# EAGLE design brick_i2c_3axis_adxl345 (EAGLE 7.4.0)
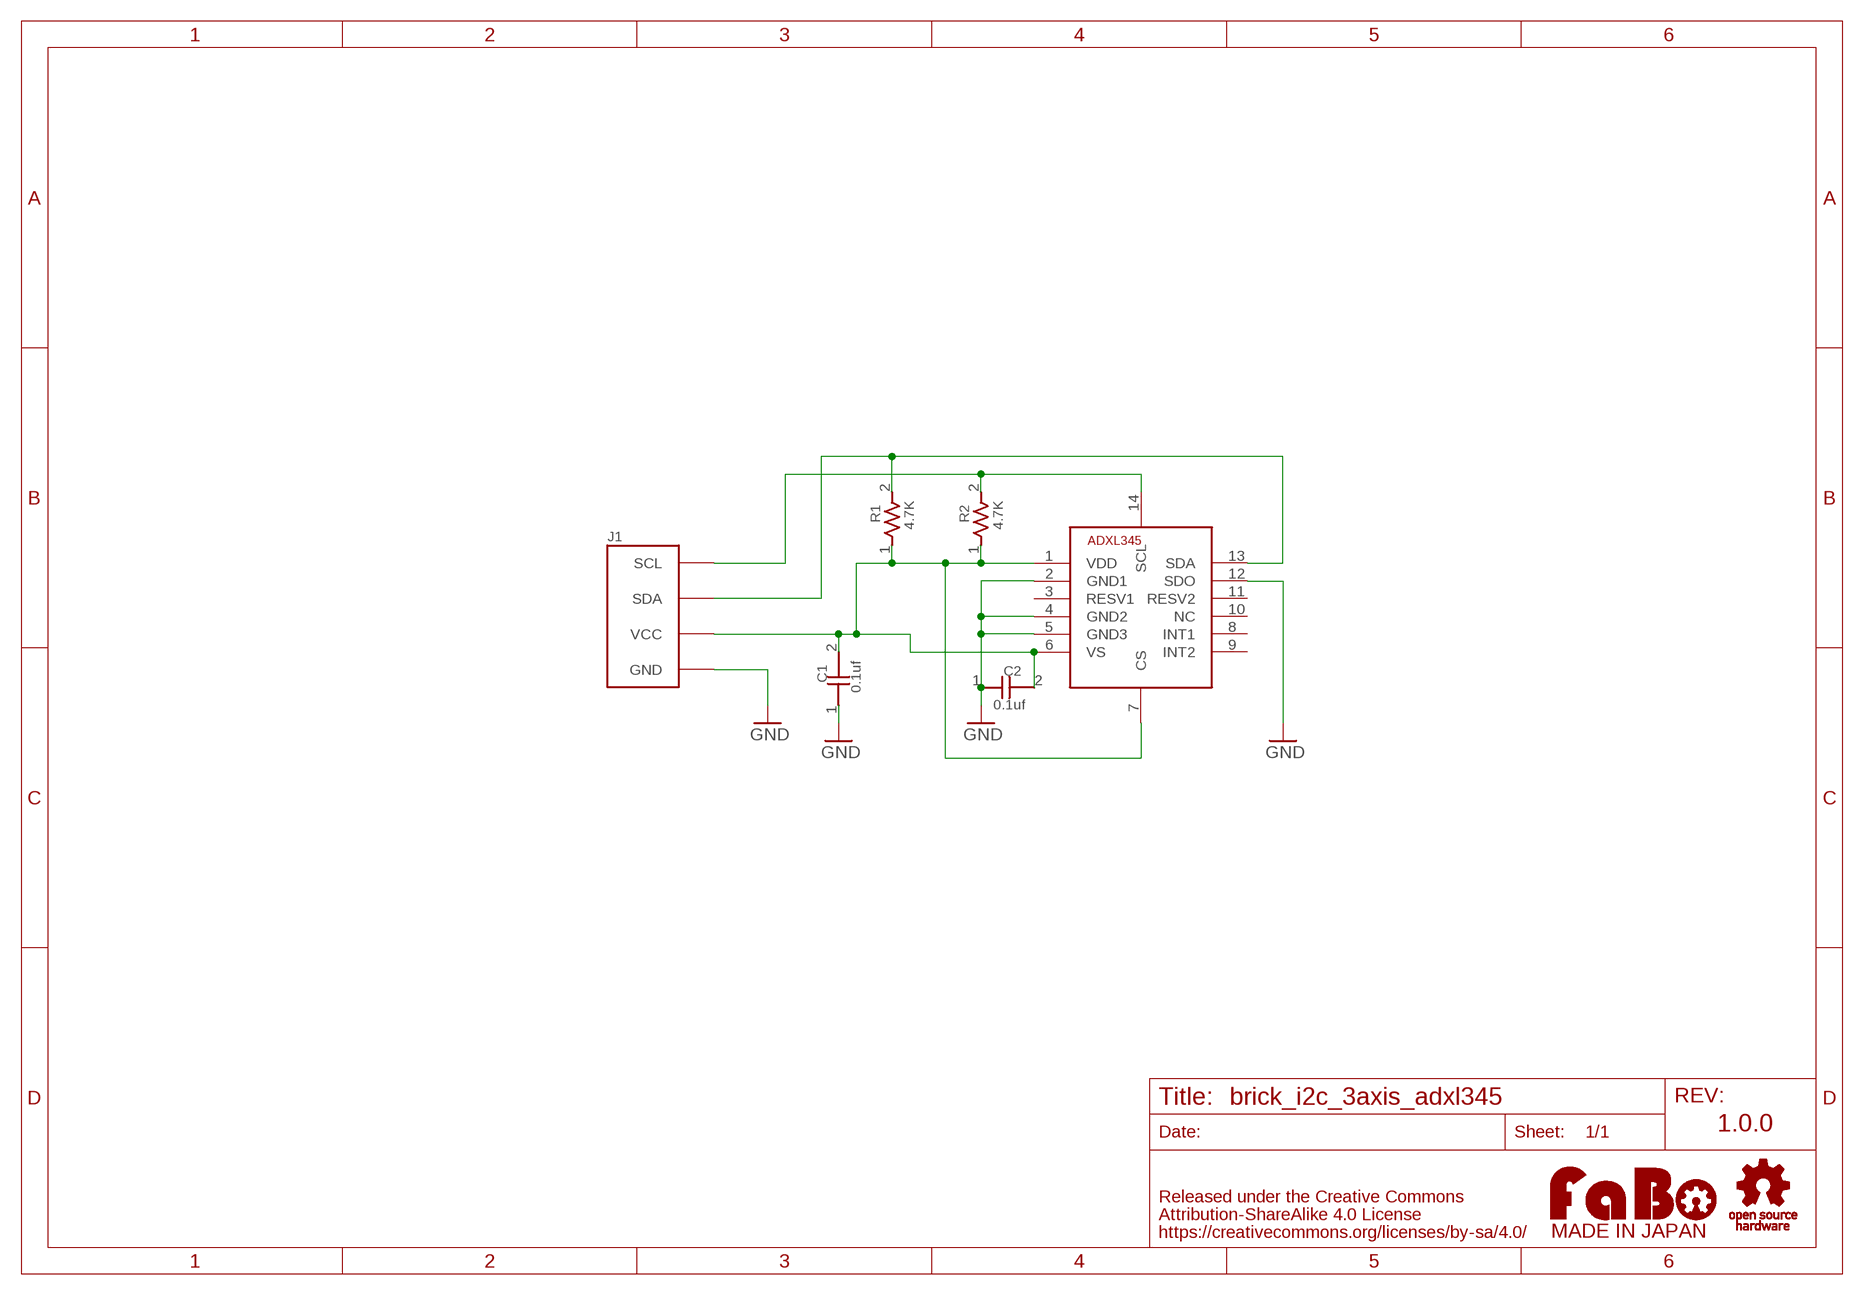
[diagram p0: schematic, sheet 1]

## Parts
C1  0.1uf  CAPACITOR0603  [0603]
C2  0.1uf  CAPACITOR0603  [0603]
J1  BRICK_I2C  [BRICK_I2C]
R1  4.7K  RESISTOR0603  [0603]
R2  4.7K  RESISTOR0603  [0603]
U$2  ANALOGDEVICES-ADXL345  [ANALOGDEVICES-ADXL345]
U$3  LOGO_OSHW_T-M  [LOGO_OSHW_T_M]
U$4  LOGO_FABO-M  [LOGO_FABO_M]

## Nets
GND: C1.1 C2.1 J1.GND U$2.2(GND1) U$2.4(GND2) U$2.5(GND3) U$2.12(SDO)
N$1: C1.2 C2.2 J1.VCC R1.1 R2.1 U$2.1(VDD) U$2.6(VS) U$2.7(CS)
N$3: J1.SDA R1.2 U$2.13(SDA)
N$4: J1.SCL R2.2 U$2.14(SCL)
Unconnected: U$2.3(RESV1) U$2.8(INT1) U$2.9(INT2) U$2.10(NC) U$2.11(RESV2)

## Notes on the sheet
- 1.0.0

## Library data of the parts
C1 C2 = GClue-Capacitor:CAPACITOR
J1 = gclue:BRICK_I2C: FaBo Brick 4pin(I2C)
R1 R2 = GClue-Resistors:RESISTOR
U$2 = GClue-Mems:ANALOGDEVICES-ADXL345
U$3 = gclue:LOGO_OSHW_T
U$4 = FaBo-etc:LOGO_FABO

## Net classes
0 default: width 0.254 mm

## Board
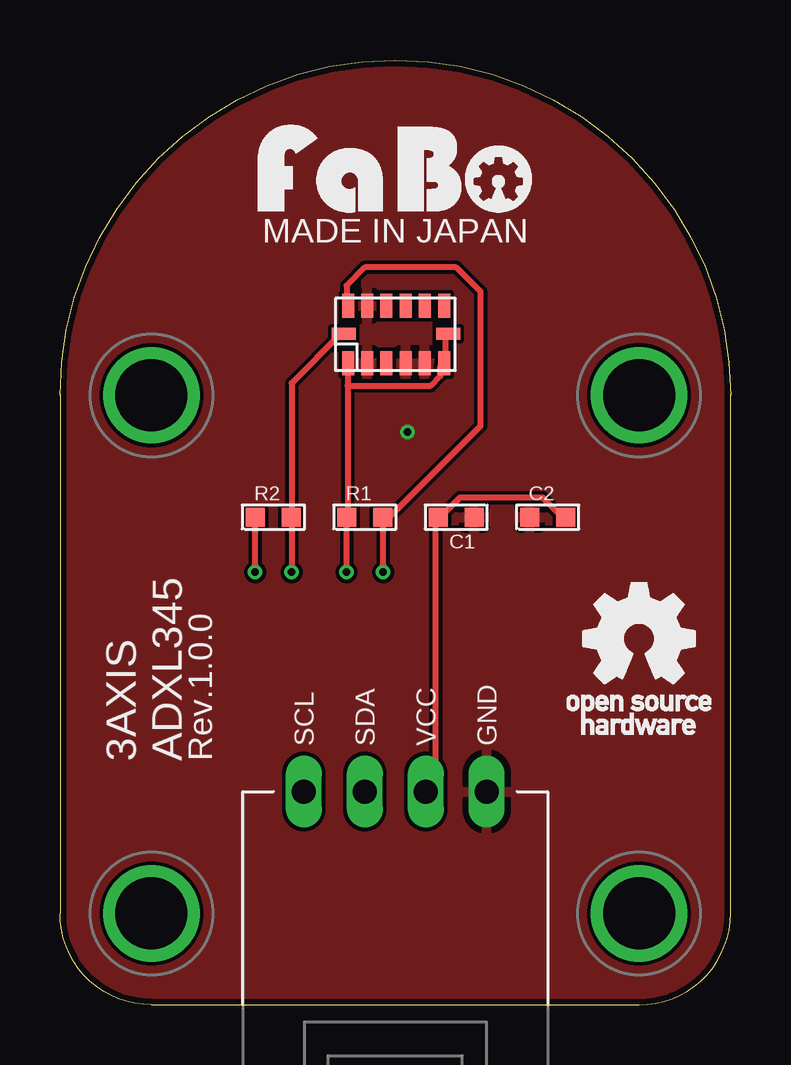
[diagram p1: board, top side]
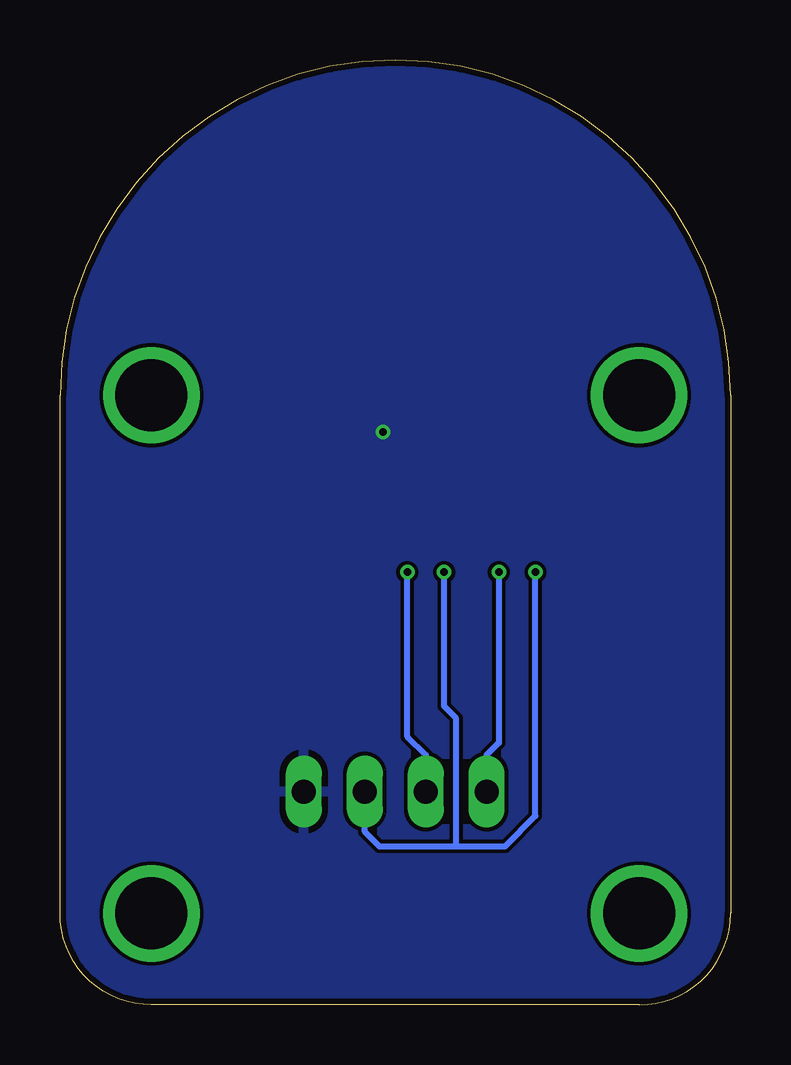
[diagram p2: board, bottom side, seen from below]

Size 27.94 x 39.37 mm. Coordinates in mm from the lower left corner, seen from the top.
Copper layers (1*16): Top 0.035mm / dielectric 1.5mm / Bottom 0.035mm
Design rules "Elecrow_2-layer_eagle_rule": minimum track width 6mil, minimum drill 12mil, track to track 6mil, track to pad 6mil, pad to pad 6mil, via to via 6mil, smd to smd 0mil, copper to edge 10mil, drill to drill 10mil, minimum pad ring 10mil, minimum via ring 6mil, stop-mask expansion 2mil, vias tented up to drill 100mil, thermal gap 10mil

### Footprints (pad centres in the part's own frame; a part is rotated, then mirrored left to right if it is on the bottom)
0603 = smd 0.8 x 0.8: 1 -0.75,0; 2 0.75,0
BRICK_I2C = drill 1 long: GND 3.81,-10.16; SCL -3.81,-10.16; SDA -1.27,-10.16; VCC 1.27,-10.16 | drill 3 pad 3.81: P$1 -10.16,6.35; P$2 10.16,6.35; P$3 -10.16,-15.24; P$4 10.16,-15.24
ANALOGDEVICES-ADXL345 = smd 1 x 0.5: 1 -1.2,1.97; 2 -1.2,1.17; 3 -1.2,0.37; 4 -1.2,-0.43; 5 -1.2,-1.23; 6 -1.2,-2.03; 8 1.2,-2.03; 9 1.2,-1.23; 10 1.2,-0.43; 11 1.2,0.37; 12 1.2,1.17; 13 1.2,1.97 | smd 0.5 x 1: 7 0.03,-2.2; 14 0.03,2.15

### Placement (x,y rotation side)
C1  16.51,20.32 180 top
C2  20.32,20.32 0 top
J1  13.97,19.05 0 top
R1  12.7,20.32 0 top
R2  8.89,20.32 0 top
U$2  13.97,27.94 90 top
U$3  24.13,15.24 0 top
U$4  13.97,33.02 0 top

### Tracks (layer width: path | path; a pad name or v marks a point on that pad's centre or on a via)
GND  (via drill 0.3)
  other vias: 14.48,23.88
  pour Bottom: -1.27,-1.27 29.21,-1.27 29.21,40.64 -1.27,40.64
  pour Top: -1.27,-1.27 29.21,-1.27 29.21,40.64 -1.27,40.64
N$1  (via drill 0.3)
  Top 0.254: U$2.7 16.05,27.84 16.05,26.82 U$2.6 15.85,26.62 15.85,26.21 15.44,25.81 11.99,25.81 | 11.99,25.81 11.99,26.62 U$2.1 | 11.99,25.81 11.99,20.32 R1.1 11.94,20.32 v11.94,18.03 | C2.2 20.93,20.32 20.12,21.13 16.66,21.13 15.85,20.32 C1.2 15.65,20.32 15.65,9.35 15.24,8.94 J1.VCC | v8.13,18.03 8.13,20.32 R2.1
  Bottom 0.254: v8.13,18.03 8.13,7.87 9.4,6.6 11.43,6.6 | 11.43,6.6 14.63,6.6 15.24,7.21 J1.VCC | v11.94,18.03 11.94,12.45 11.43,11.94 11.43,6.6
N$3  (via drill 0.3)
  Top 0.254: v13.46,18.03 13.46,20.32 | U$2.13 11.94,29.21 11.94,29.97 12.7,30.73 16.51,30.73 17.53,29.72 17.53,24.13 13.72,20.32 13.46,20.32 | 13.46,20.32 R1.2
  Bottom 0.254: v13.46,18.03 13.46,11.18 12.7,10.41 J1.SDA
N$4  (via drill 0.3)
  Top 0.254: 9.65,20.32 9.65,25.91 11.68,27.94 U$2.14 | 9.65,20.32 v9.65,18.03 | 9.65,20.32 R2.2
  Bottom 0.254: v9.65,18.03 9.65,10.92 10.16,10.41 J1.SCL

### Text on the board
tPlace: MADE IN JAPAN | 3AXIS / ADXL345 | Rev.1.0.0